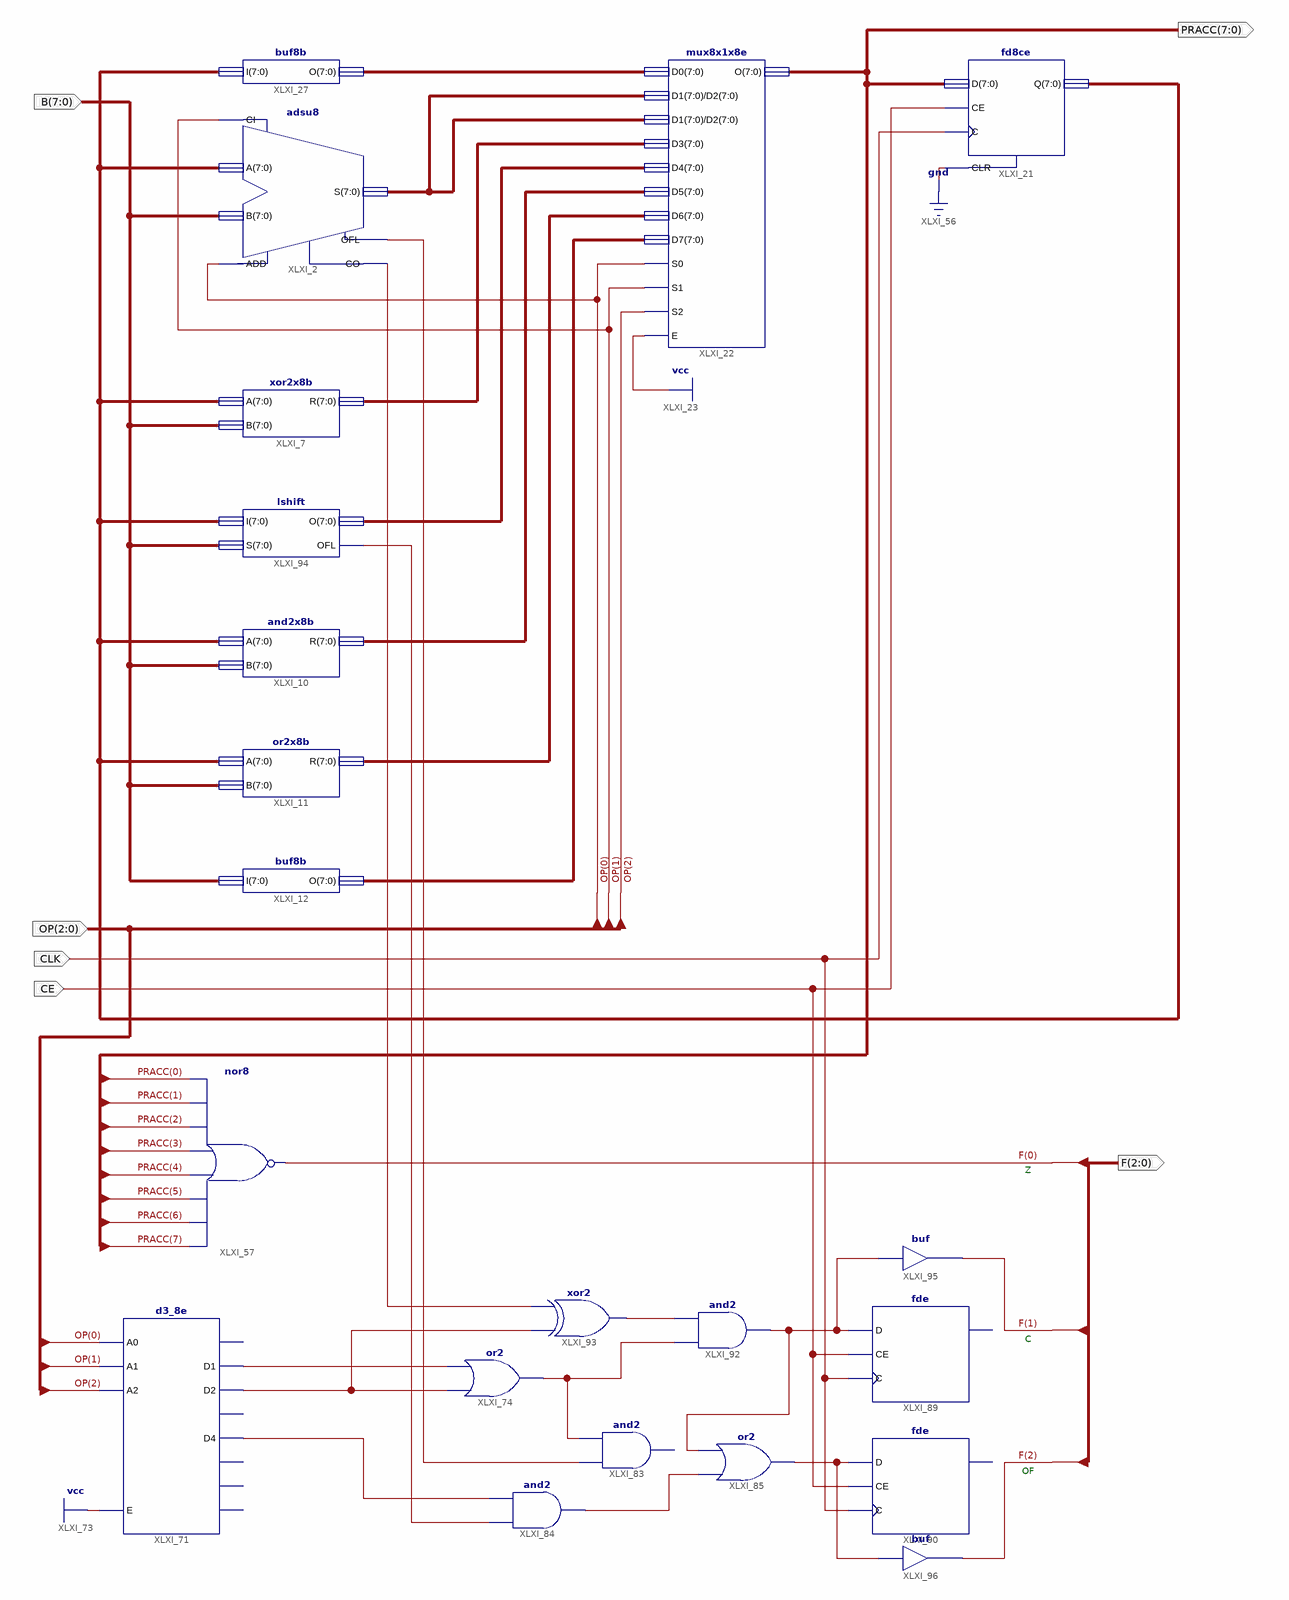
[diagram p0: schematic sheet 1]
// Xilinx ISE schematic alu.sch (spartan6) as structural Verilog: 21 symbols, 6 ports
module alu (
  input  [7:0] B,
  input  CLK,
  input  CE,
  input  [2:0] OP,
  output [7:0] PRACC,
  output [2:0] F
);

  wire XLXN_135, XLXN_136, XLXN_137, XLXN_160, XLXN_162, XLXN_170, XLXN_179, XLXN_181, XLXN_182, XLXN_194,
       XLXN_195;
  wire [7:0] ACC, XLXN_4, XLXN_7, XLXN_8, XLXN_9, XLXN_10, XLXN_11, XLXN_107;

  xor2x8b XLXI_7 (.A(ACC), .B(B), .R(XLXN_7));
  and2x8b XLXI_10 (.A(ACC), .B(B), .R(XLXN_9));
  or2x8b XLXI_11 (.A(ACC), .B(B), .R(XLXN_10));
  buf8b XLXI_12 (.I(B), .O(XLXN_11));
  fd8ce XLXI_21 (.C(CLK), .CE(CE), .CLR(1'b0), .D(PRACC), .Q(ACC));
  mux8x1x8e XLXI_22 (
    .D0(XLXN_4), .D1(XLXN_107), .D2(XLXN_107), .D3(XLXN_7), .D4(XLXN_8), .D5(XLXN_9), .D6(XLXN_10),
    .D7(XLXN_11), .E(1'b1), .O(PRACC), .S0(OP[0]), .S1(OP[1]), .S2(OP[2]));
  buf8b XLXI_27 (.I(ACC), .O(XLXN_4));
  adsu8 XLXI_2 (.A(ACC), .ADD(OP[0]), .B(B), .CI(OP[1]), .CO(XLXN_135), .OFL(XLXN_136), .S(XLXN_107));
  nor XLXI_57 (F[0], PRACC[7], PRACC[6], PRACC[5], PRACC[4], PRACC[3], PRACC[2], PRACC[1], PRACC[0]);
  d3_8e XLXI_71 (
    .A0(OP[0]), .A1(OP[1]), .A2(OP[2]), .E(1'b1), .D1(XLXN_181), .D2(XLXN_182), .D4(XLXN_160));  // open: D0, D3, D5, D6, D7
  or XLXI_74 (XLXN_170, XLXN_182, XLXN_181);
  // and2 XLXI_83 has open pins: I0=XLXN_136, I1=XLXN_170, O=open
  and XLXI_84 (XLXN_162, XLXN_137, XLXN_160);
  or XLXI_85 (XLXN_195, XLXN_162, XLXN_194);
  fde XLXI_90 (.C(CLK), .CE(CE), .D(XLXN_195));  // open: Q
  fde XLXI_89 (.C(CLK), .CE(CE), .D(XLXN_194));  // open: Q
  and XLXI_92 (XLXN_194, XLXN_170, XLXN_179);
  xor XLXI_93 (XLXN_179, XLXN_182, XLXN_135);
  lshift XLXI_94 (.I(ACC), .O(XLXN_8), .OFL(XLXN_137), .S(B));
  buf XLXI_95 (F[1], XLXN_194);
  buf XLXI_96 (F[2], XLXN_195);

  // Notes on the sheet:
  //   Z
  //   C
  //   OF
endmodule
